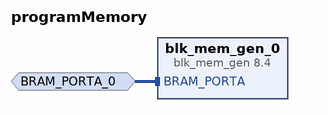
[diagram p0: block diagram of the top level]
# Vivado block design programMemory, xc7a100tcsg324-1, Vivado 2019.2
create_bd_design programMemory

create_bd_intf_port -mode Slave -vlnv xilinx.com:interface:bram_rtl:1.0 BRAM_PORTA_0
set_property -dict {CONFIG.MASTER_TYPE BRAM_CTRL} [get_bd_intf_ports BRAM_PORTA_0]

create_bd_cell -type ip -vlnv xilinx.com:ip:blk_mem_gen:8.4 blk_mem_gen_0

# ---- connections ----

connect_bd_intf_net -intf_net BRAM_PORTA_0_1 [get_bd_intf_ports BRAM_PORTA_0] [get_bd_intf_pins blk_mem_gen_0/BRAM_PORTA]

validate_bd_design
save_bd_design
